# EAGLE design emission (EAGLE 6.6.0)
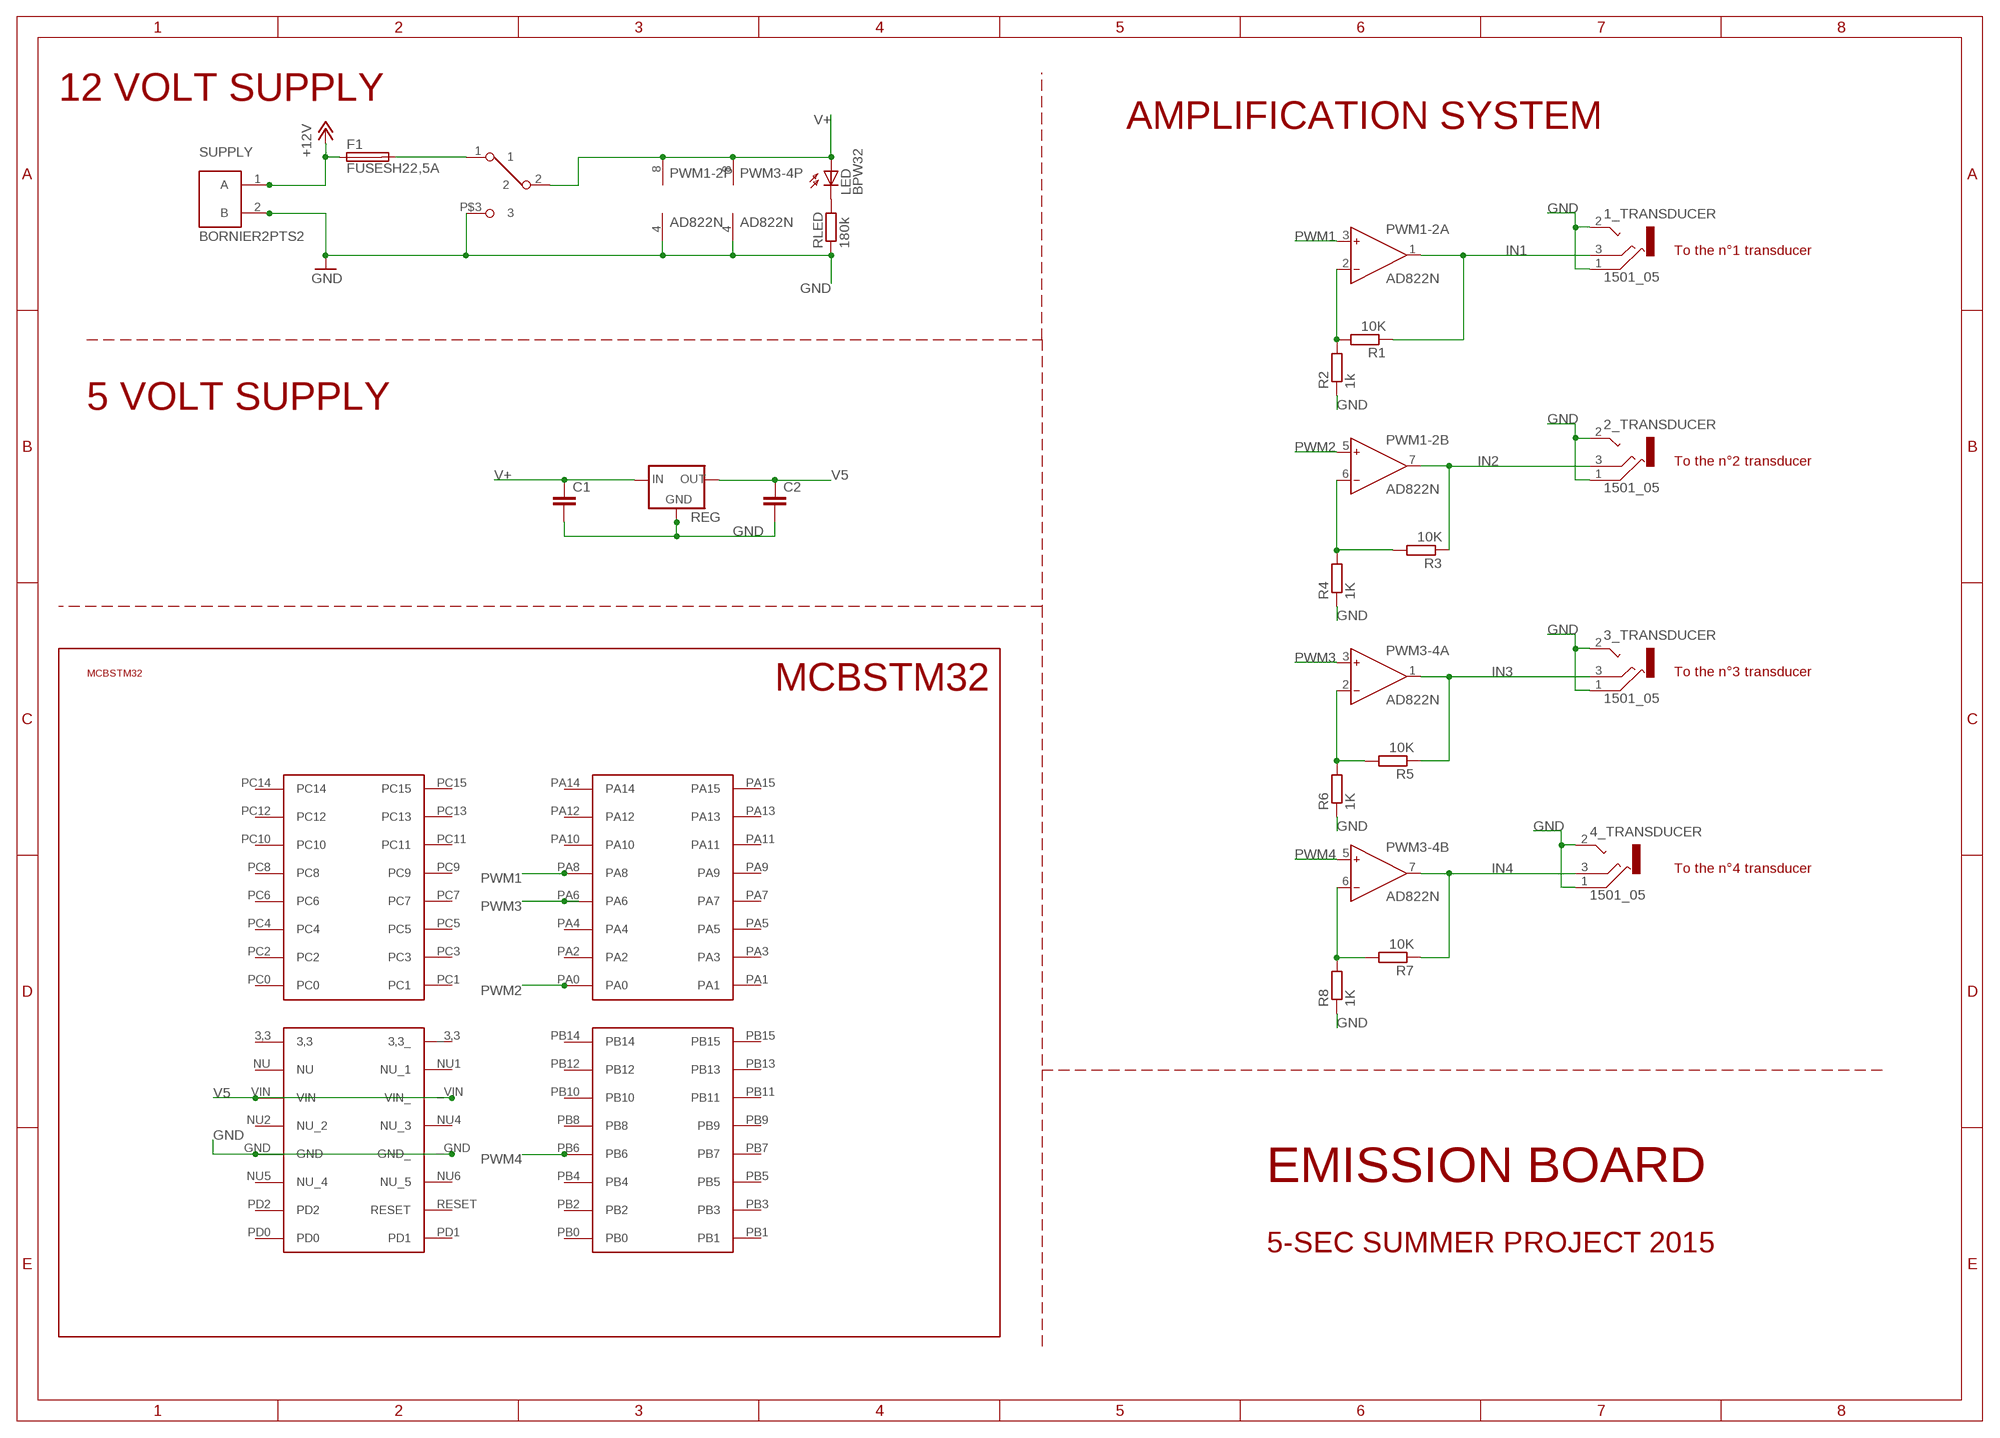
[diagram p0: schematic, sheet 1]

## Parts
1_TRANSDUCER  1501_05  [1501_05]
2_TRANSDUCER  1501_05  [1501_05]
3_TRANSDUCER  1501_05  [1501_05]
4_TRANSDUCER  1501_05  [1501_05]
C1  C-EU050-030X075  [C050-030X075]
C2  C-EU050-030X075  [C050-030X075]
F1  FUSESH22,5A  [SH22,5A]
LED  BPW32  [BPW32]
MCBSTM1  CONNECTOR_MCBSTM32  [CONNECTORSTM]
PWM1-2  AD822N  [DIL08]
PWM3-4  AD822N  [DIL08]
R1  10K  R-EU_0613/15  [P0613/15]
R2  1k  R-EU_0613/15  [P0613/15]
R3  10K  R-EU_0613/15  [P0613/15]
R4  1K  R-EU_0613/15  [P0613/15]
R5  10K  R-EU_0613/15  [P0613/15]
R6  1K  R-EU_0613/15  [P0613/15]
R7  10K  R-EU_0613/15  [P0613/15]
R8  1K  R-EU_0613/15  [P0613/15]
REG  78XXS  [78XXS]
RLED  180k  R-EU_0613/15  [P0613/15]
SUPPLY  BORNIER2PTS2  [BORN2X5.08]
U$2  SWITCH_CKCOMPONENT  [SWITCH_CKCOMPONENT]

## Nets
+12V: F1.1 SUPPLY.1(A)
GND: 1_TRANSDUCER.1 1_TRANSDUCER.2 2_TRANSDUCER.1 2_TRANSDUCER.2 3_TRANSDUCER.1 3_TRANSDUCER.2 4_TRANSDUCER.1 4_TRANSDUCER.2 C1.2 C2.2 MCBSTM1._GND(GND_) MCBSTM1.GND PWM1-2.4(P:V-) PWM3-4.4(P:V-) R2.1 R4.1 R6.1 R8.1 REG.GND RLED.1 SUPPLY.2(B) U$2.P$3
IN1: 1_TRANSDUCER.3 PWM1-2.1(A:OUT) R1.1
IN2: 2_TRANSDUCER.3 PWM1-2.7(B:OUT) R3.1
IN3: 3_TRANSDUCER.3 PWM3-4.1(A:OUT) R5.1
IN4: 4_TRANSDUCER.3 PWM3-4.7(B:OUT) R7.1
N$1: PWM1-2.2(A:IN-) R1.2 R2.2
N$2: PWM1-2.6(B:IN-) R3.2 R4.2
N$3: F1.2 U$2.1
N$4: PWM3-4.2(A:IN-) R5.2 R6.2
N$5: PWM3-4.6(B:IN-) R7.2 R8.2
N$7: LED.K(C) RLED.2
PWM1: MCBSTM1.PA8 PWM1-2.3(A:IN+)
PWM2: MCBSTM1.PA0 PWM1-2.5(B:IN+)
PWM3: MCBSTM1.PA6 PWM3-4.3(A:IN+)
PWM4: MCBSTM1.PB6 PWM3-4.5(B:IN+)
V5: C2.1 MCBSTM1._VIN(VIN_) MCBSTM1.VIN REG.OUT
V+: C1.1 LED.A PWM1-2.8(P:V+) PWM3-4.8(P:V+) REG.IN U$2.2
Unconnected: MCBSTM1.3,3 MCBSTM1._3,3(3,3_) MCBSTM1.NU MCBSTM1.NU1(NU_1) MCBSTM1.NU2(NU_2) MCBSTM1.NU4(NU_3) MCBSTM1.NU5(NU_4) MCBSTM1.NU6(NU_5) MCBSTM1.PA1 MCBSTM1.PA2 MCBSTM1.PA3 MCBSTM1.PA4 MCBSTM1.PA5 MCBSTM1.PA7 MCBSTM1.PA9 MCBSTM1.PA10 MCBSTM1.PA11 MCBSTM1.PA12 MCBSTM1.PA13 MCBSTM1.PA14 MCBSTM1.PA15 MCBSTM1.PB0 MCBSTM1.PB1 MCBSTM1.PB2 MCBSTM1.PB3 MCBSTM1.PB4 MCBSTM1.PB5 MCBSTM1.PB7 MCBSTM1.PB8 MCBSTM1.PB9 MCBSTM1.PB10 MCBSTM1.PB11 MCBSTM1.PB12 MCBSTM1.PB13 MCBSTM1.PB14 MCBSTM1.PB15 MCBSTM1.PC0 MCBSTM1.PC1 MCBSTM1.PC2 MCBSTM1.PC3 MCBSTM1.PC4 MCBSTM1.PC5 MCBSTM1.PC6 MCBSTM1.PC7 MCBSTM1.PC8 MCBSTM1.PC9 MCBSTM1.PC10 MCBSTM1.PC11 MCBSTM1.PC12 MCBSTM1.PC13 MCBSTM1.PC14 MCBSTM1.PC15 MCBSTM1.PD0 MCBSTM1.PD1 MCBSTM1.PD2 MCBSTM1.RESET

## Notes on the sheet
- 12 VOLT SUPPLY
- AMPLIFICATION SYSTEM
- To the n°1 transducer
- 5 VOLT SUPPLY
- To the n°2 transducer
- To the n°3 transducer
- MCBSTM32
- To the n°4 transducer
- EMISSION BOARD
- 5-SEC SUMMER PROJECT 2015

## Library data of the parts
1_TRANSDUCER 2_TRANSDUCER 3_TRANSDUCER 4_TRANSDUCER = con-lumberg:1501_0*: Jack connectors according to JISC 6560, 2.5 mm Klinkensteckverbinder nach JISC 6560, 2,5 mm Source: http://www.lumberg.com/Produkte/PDFs/1501_05.pdfedit 1501_03 http://www.lumberg.com/Produkte/PDFs/1501_06.pdf; OC_FARNELL: 1216978; OC_NEWARK: unknown
C1 C2 = rcl:C-EU: CAPACITOR, European symbol
F1 = fuse:FUSE: Fuse; OC_FARNELL: unknown; OC_NEWARK: unknown
LED = opto-trans-siemens:BPW32: PHOTO DIODE; OC_FARNELL: unknown; OC_NEWARK: unknown
MCBSTM1 = STMconnector:CONNECTOR_MCBSTM32
PWM1-2 PWM3-4 = analog-devices:AD822: Single-Supply, Rail-to-Rail Low Power FET-Input Op Amp Source: http://www.analog.com/static/imported-files/data_sheets/AD822.pdf; OC_FARNELL: 1438581; OC_NEWARK: unknown
R1-R8 = rcl:R-EU_: RESISTOR, European symbol
REG = v-reg:78XXS: VOLTAGE REGULATOR
RLED = resistor:R-EU_: RESISTOR, European symbol
SUPPLY = MesConnecteurs:BORNIER2PTS
U$2 = Switch-CKcomponent:SWITCH_CKCOMPONENT

## Board
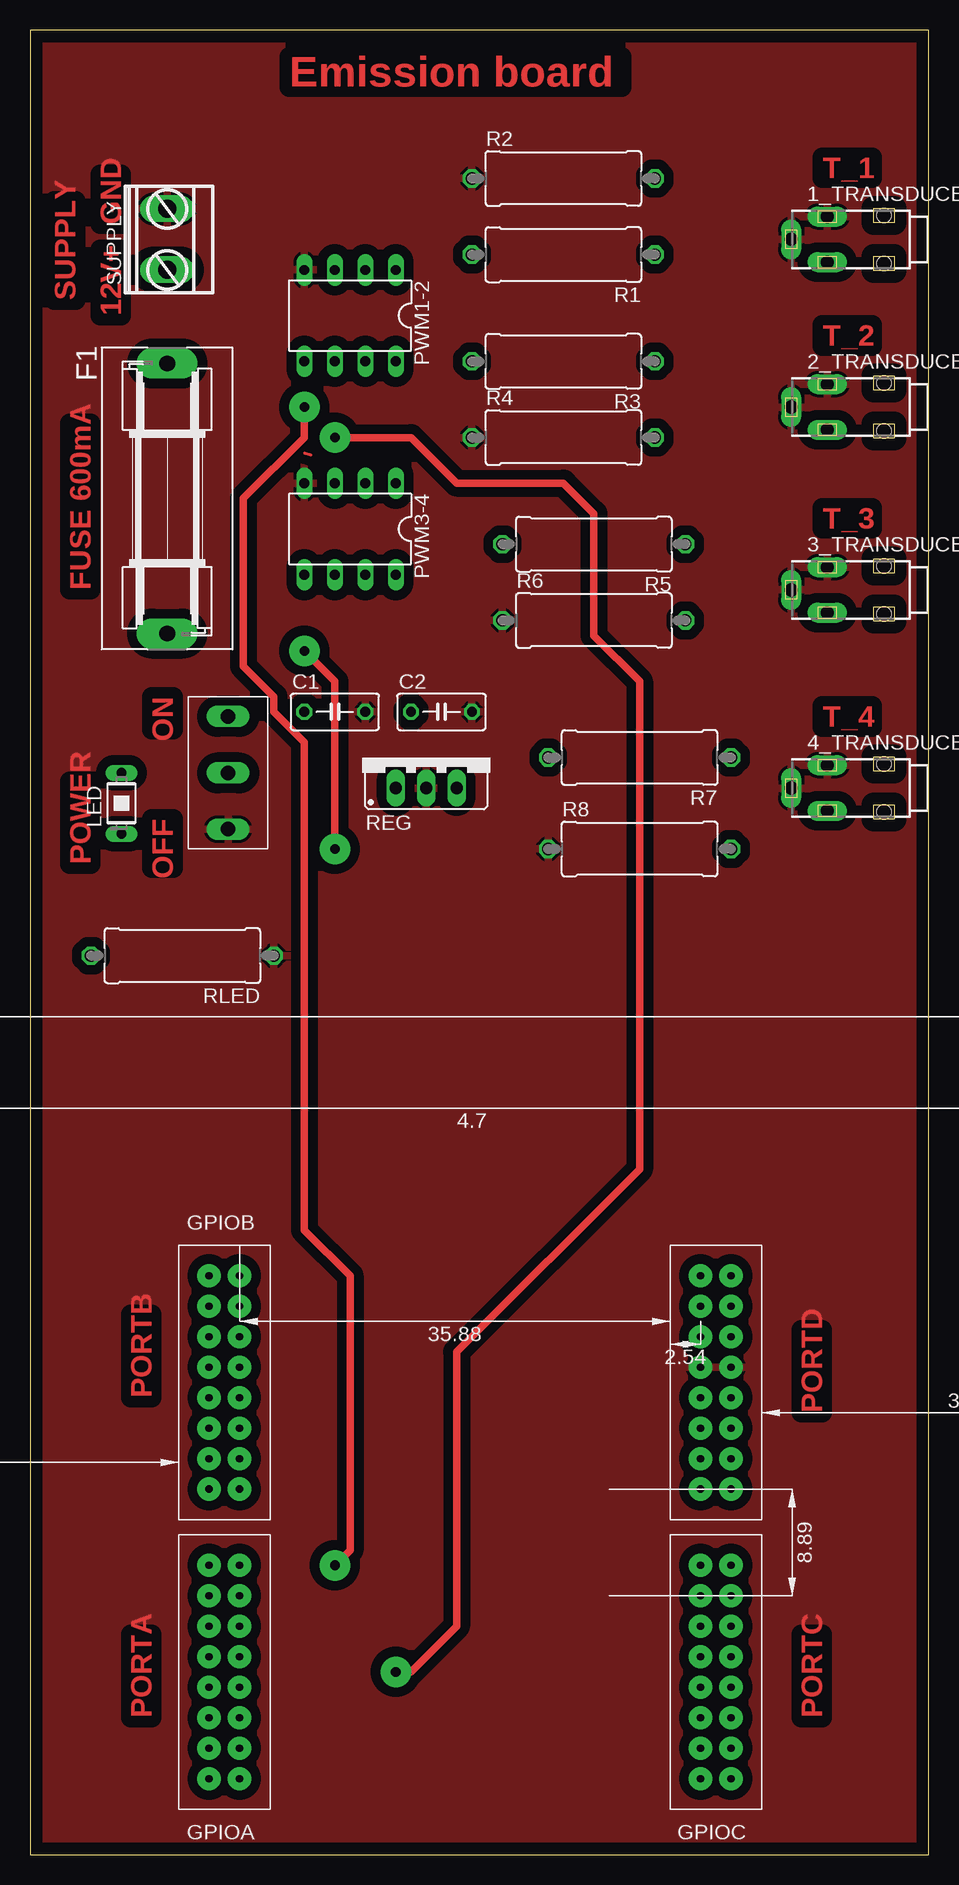
[diagram p1: board, top side]
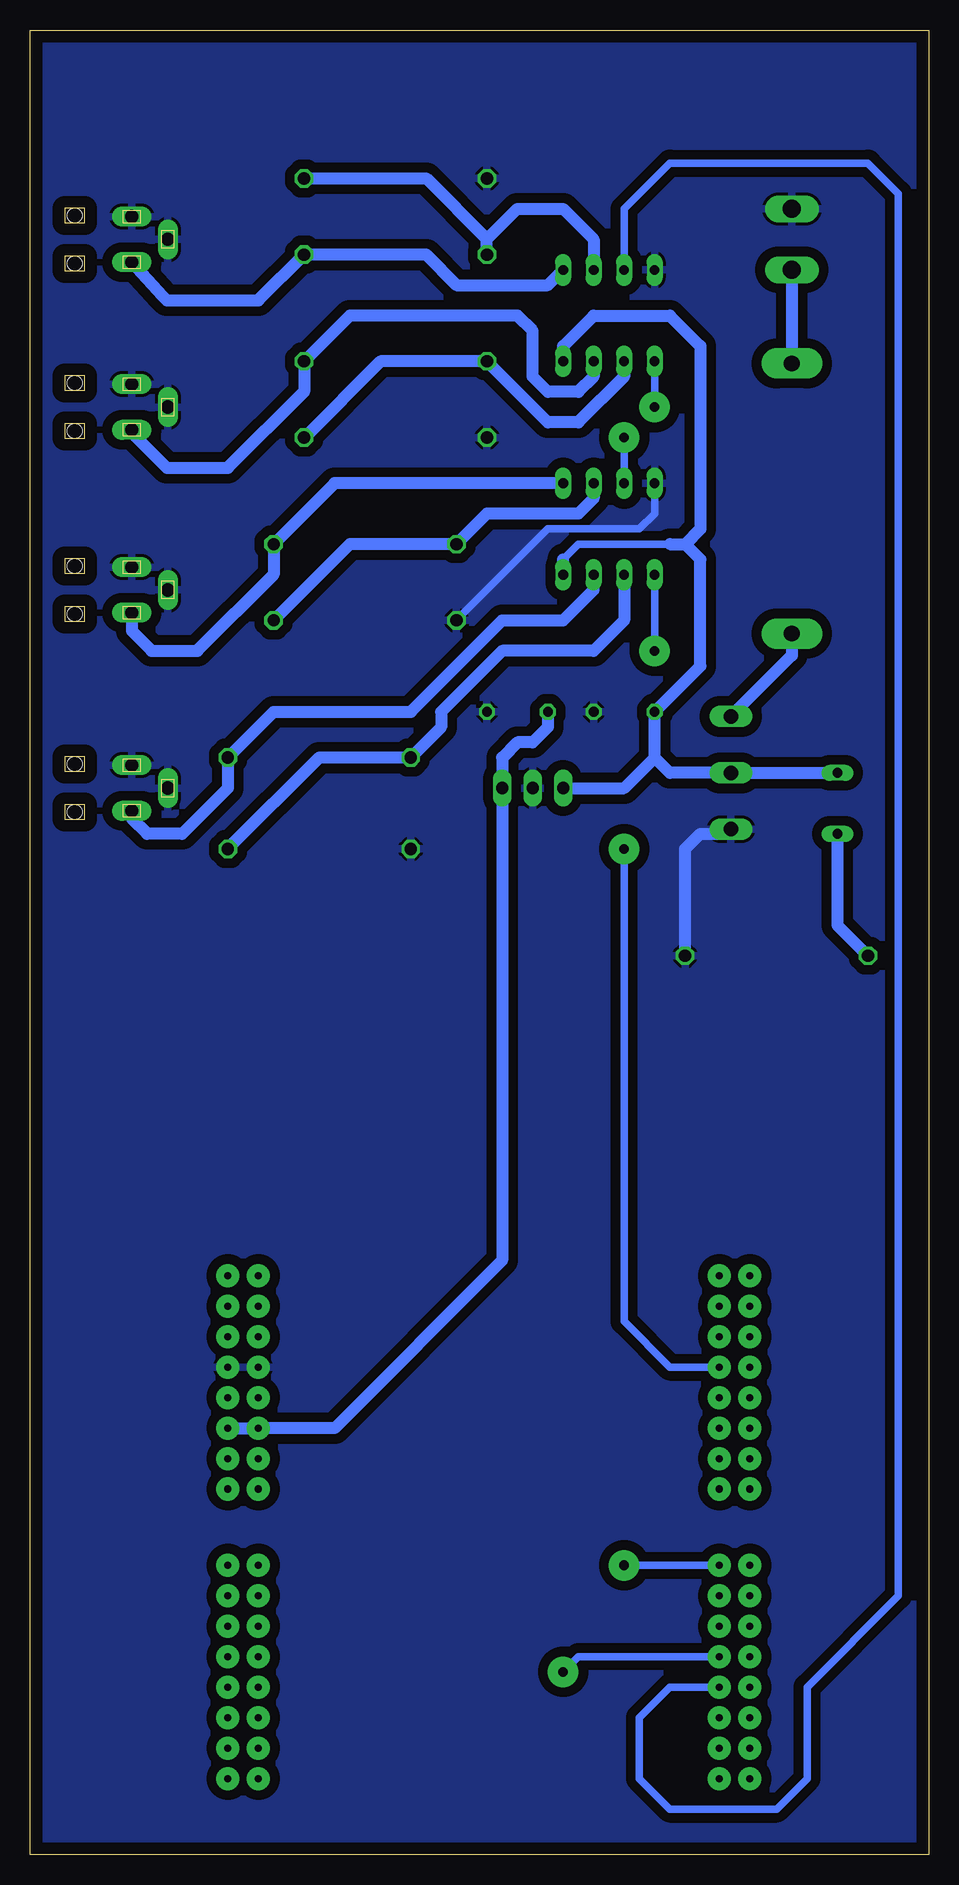
[diagram p2: board, bottom side, seen from below]

Size 74.91 x 152.07 mm. Coordinates in mm from the lower left corner, seen from the top.
Outline: 0,0 74.91,0 74.91,152.07 0,152.07 0,0
Copper layers (1*16): Top 0.035mm / dielectric 1.5mm / Bottom 0.035mm
Design rules "default": minimum track width 10mil, minimum drill 24mil, track to track 8mil, track to pad 8mil, pad to pad 8mil, via to via 8mil, smd to smd 8mil, copper to edge 40mil, drill to drill 8mil, minimum pad ring 10mil, minimum via ring 8mil, stop-mask expansion 4mil, vias tented up to drill 0mil, thermal gap 10mil

### Footprints (pad centres in the part's own frame; a part is rotated, then mirrored left to right if it is on the bottom)
1501_05 = drill 1.1 pad 1.4 long: 1 -1.9,-8.5; 2 0,-11.5; 3 1.9,-8.5 | hole 1.2: -2,-3.75; 2,-3.75
C050-030X075 = drill 0.813 octagon: 1 -2.54,0; 2 2.54,0
SH22,5A = drill 1.321 pad 2.54 long: 1 -11.252,0; 2 11.252,0
BPW32 = drill 0.813 long: A 0,2.54; K 0,-2.54
CONNECTORSTM = drill 0.6 pad 1.93: 3,3 -22.86,-5.08; _3,3 -20.32,-5.08; _GND -20.32,-15.24; _VIN -20.32,-10.16; GND -22.86,-15.24; NU -22.86,-7.62; NU1 -20.32,-7.62; NU2 -22.86,-12.7; NU4 -20.32,-12.7; NU5 -22.86,-17.78; NU6 -20.32,-17.78; PA0 18.098,1.27; PA1 20.637,1.27; PA2 18.098,3.81; PA3 20.637,3.81; PA4 18.098,6.35; PA5 20.637,6.35; PA6 18.098,8.89; PA7 20.637,8.89; PA8 18.098,11.43; PA9 20.637,11.43; PA10 18.098,13.97; PA11 20.637,13.97; PA12 18.098,16.51; PA13 20.637,16.51; PA14 18.098,19.05; PA15 20.637,19.05; PB0 18.098,-22.86; PB1 20.637,-22.86; PB2 18.098,-20.32; PB3 20.637,-20.32; PB4 18.098,-17.78; PB5 20.637,-17.78; PB6 18.098,-15.24; PB7 20.637,-15.24; PB8 18.098,-12.7; PB9 20.637,-12.7; PB10 18.098,-10.16; PB11 20.637,-10.16; PB12 18.098,-7.62; PB13 20.637,-7.62; PB14 18.098,-5.08; PB15 20.637,-5.08; PC0 -22.86,1.27; PC1 -20.32,1.27; PC2 -22.86,3.81; PC3 -20.32,3.81; PC4 -22.86,6.35; PC5 -20.32,6.35; PC6 -22.86,8.89; PC7 -20.32,8.89; PC8 -22.86,11.43; PC9 -20.32,11.43; PC10 -22.86,13.97; PC11 -20.32,13.97; PC12 -22.86,16.51; PC13 -20.32,16.51; PC14 -22.86,19.05; PC15 -20.32,19.05; PD0 -22.86,-22.86; PD1 -20.32,-22.86; PD2 -22.86,-20.32; RESET -20.32,-20.32; VIN -22.86,-10.16
DIL08 = drill 0.813 long: 1 -3.81,-3.81; 2 -1.27,-3.81; 3 1.27,-3.81; 4 3.81,-3.81; 5 3.81,3.81; 6 1.27,3.81; 7 -1.27,3.81; 8 -3.81,3.81
P0613/15 = drill 1.016 octagon: 1 -7.62,0; 2 7.62,0
78XXS = drill 1.016 long: GND 0,-2.54; IN -2.54,-2.54; OUT 2.54,-2.54
BORN2X5.08 = drill 1.5 pad 1.93 long: 1 -2.54,0; 2 2.54,0
SWITCH_CKCOMPONENT = drill 1.2 long: 1 4.699,0; 2 0,0; P$3 -4.699,0

### Placement (x,y rotation side)
1_TRANSDUCER  74.93,134.62 270 top
2_TRANSDUCER  74.93,120.65 270 top
3_TRANSDUCER  74.93,105.41 270 top
4_TRANSDUCER  74.93,88.9 270 top
C1  25.4,95.25 0 top
C2  34.29,95.25 0 top
F1  11.43,113.03 270 top
LED  7.62,87.63 0 top
MCBSTM1  35.56,25.4 180 top
PWM1-2  26.67,128.27 180 top
PWM3-4  26.67,110.49 180 top
R1  44.45,133.35 180 top
R2  44.45,139.7 0 top
R3  44.45,124.46 180 top
R4  44.45,118.11 0 top
R5  46.99,109.22 180 top
R6  46.99,102.87 0 top
R7  50.8,91.44 180 top
R8  50.8,83.82 0 top
REG  33.02,91.44 0 top
RLED  12.7,74.93 180 top
SUPPLY  11.43,134.62 90 top
U$2  16.51,90.17 90 top

### Tracks (layer width: path | path; a pad name or v marks a point on that pad's centre or on a via)
+12V
  Bottom 1.016: SUPPLY.1 F1.1
GND
  Bottom 0.61: PWM3-4.4 22.86,111.76 24.13,110.49 31.75,110.49 R6.1
  Bottom 1.016: RLED.1 20.32,83.82 19.05,85.09 16.89,85.09 U$2.P$3
  pour Bottom (isolate 0.813): 0,153.67 74.93,153.67 74.93,0 0,0
  pour Top (isolate 0.813): 0,152.4 74.93,152.4 74.93,0 0,0
IN1
  Bottom 1.016: 1_TRANSDUCER.3 63.89,129.93 63.5,129.54 55.88,129.54 R1.1 41.91,133.35 39.37,130.81 31.75,130.81 PWM1-2.1
IN2
  Bottom 1.016: 2_TRANSDUCER.3 66.43,118.5 63.5,115.57 58.42,115.57 52.07,121.92 R3.1 48.26,128.27 34.29,128.27 33.02,127 33.02,123.19 31.75,121.92 29.21,121.92 27.94,123.19 PWM1-2.7
IN3
  Bottom 1.016: 3_TRANSDUCER.3 66.43,101.99 64.77,100.33 60.96,100.33 54.61,106.68 R5.1 49.53,114.3 PWM3-4.1
IN4
  Bottom 1.016: 4_TRANSDUCER.3 66.43,86.36 65.16,85.09 62.23,85.09 58.42,88.9 R7.1 54.61,95.25 43.18,95.25 35.56,102.87 30.48,102.87 27.94,105.41 PWM3-4.7
N$1
  Bottom 1.016: R1.2 36.83,134.62 | 36.83,134.62 34.29,137.16 30.48,137.16 27.94,134.62 PWM1-2.2 | R2.2 41.91,139.7 36.83,134.62
N$2
  Bottom 1.016: PWM1-2.6 25.4,123.19 29.21,119.38 31.75,119.38 R3.2 45.72,124.46 R4.2
N$3
  Bottom 1.016: F1.2 11.43,99.95 U$2.1
N$4
  Bottom 1.016: PWM3-4.2 27.94,113.03 29.21,111.76 36.83,111.76 R5.2 48.26,109.22 R6.2
N$5
  Bottom 1.016: PWM3-4.6 25.4,102.87 27.94,100.33 35.56,100.33 40.64,95.25 40.64,93.98 R7.2 50.8,91.44 R8.2
N$6
  Top 0.254: 22.86,116.84 23.42,116.66
N$7
  Bottom 1.016: LED.K 7.62,77.47 RLED.2
PWM1
  Bottom 0.61: PWM1-2.3 25.4,137.16 21.59,140.97 5.08,140.97 2.54,138.43 2.54,21.59 10.16,13.97 10.16,6.35 12.7,3.81 21.59,3.81 24.13,6.35 24.13,11.43 21.59,13.97 MCBSTM1.PA8
PWM2  (via drill 0.8 pad 2.54)
  Top 0.61: v22.86,120.65 22.86,118.11 17.78,113.03 17.78,99.06 20.32,96.52 20.32,95.25 22.86,92.71 22.86,52.07 26.67,48.26 26.67,25.4 v25.4,24.13
  Bottom 0.61: PWM1-2.5 v22.86,120.65 | v25.4,24.13 MCBSTM1.PA0
PWM3  (via drill 0.8 pad 2.54)
  Top 0.61: v25.4,118.11 31.75,118.11 35.56,114.3 44.45,114.3 46.99,111.76 46.99,101.6 50.8,97.79 50.8,57.15 35.56,41.91 35.56,19.05 31.75,15.24 v30.48,15.24
  Bottom 0.61: PWM3-4.3 v25.4,118.11 | 29.67,16.05 v30.48,15.24 29.21,16.51 MCBSTM1.PA6
PWM4  (via drill 0.8 pad 2.54)
  Top 0.61: v22.86,100.33 25.4,97.79 v25.4,83.82
  Bottom 0.61: PWM3-4.5 v22.86,100.33 | v25.4,83.82 25.4,44.45 21.59,40.64 MCBSTM1.PB6
V5
  Bottom 1.016: C2.1 31.75,93.98 33.02,92.71 34.29,92.71 35.56,91.44 REG.OUT 35.56,49.53 49.53,35.56 MCBSTM1._VIN MCBSTM1.VIN
V+
  Bottom 0.61: 30.48,107.95 29.21,109.22 21.59,109.22
  Bottom 1.016: LED.A U$2.2 21.59,90.17 22.86,91.44 | PWM1-2.8 30.48,125.73 27.94,128.27 21.59,128.27 19.05,125.73 19.05,110.49 20.32,109.22 | 22.86,91.44 C1.1 19.05,99.06 19.05,107.95 20.32,109.22 | REG.IN 25.4,88.9 22.86,91.44 | PWM3-4.8 30.48,107.95 | 21.59,109.22 20.32,109.22

### Text on the board
Top: Emission board | T_1 | GND | SUPPLY | 12V+ | T_2 | T_3 | FUSE 600mA | ON | T_4 | OFF | POWER | PORTB | PORTD | PORTA | PORTC